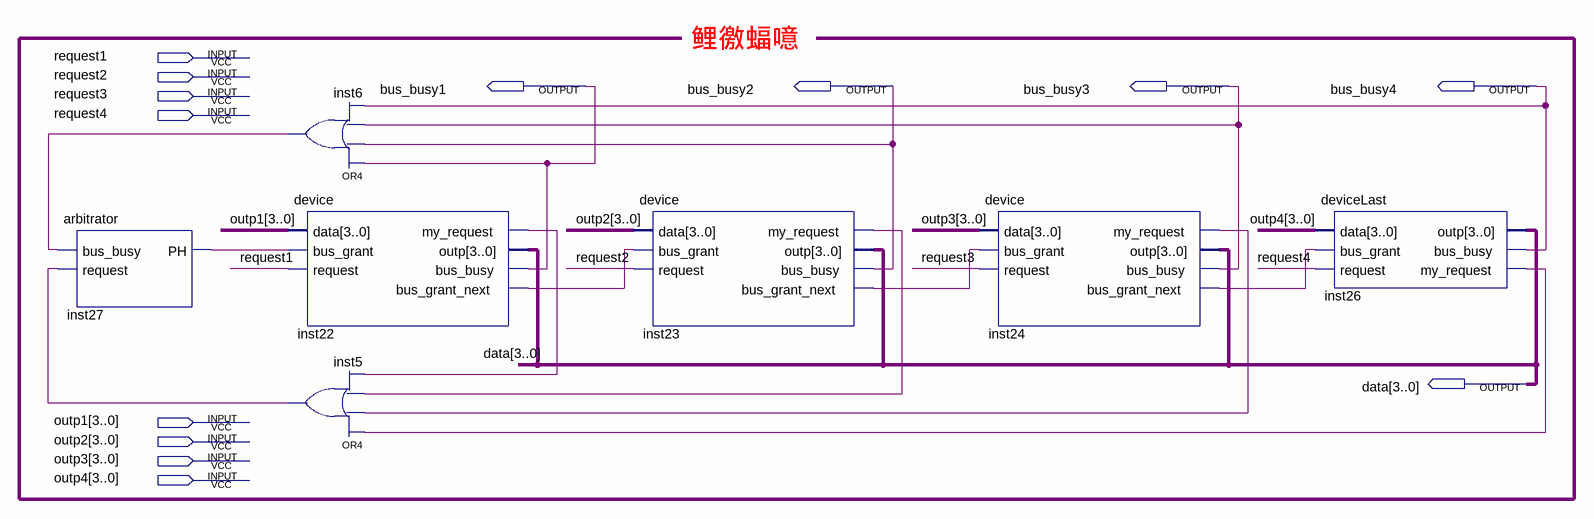
[diagram p0: schematic sheet]
// Quartus schematic Main.bdf as structural Verilog: 7 symbols, 13 pins
module Main (
  input  request1,
  input  request2,
  input  request3,
  input  request4,
  input  [3:0] outp1,
  input  [3:0] outp2,
  input  [3:0] outp3,
  input  [3:0] outp4,
  output bus_busy1,
  output bus_busy2,
  output bus_busy3,
  output bus_busy4,
  output [3:0] data
);

  wire inst5_out, inst6_out, inst22_bus_grant_next, inst22_my_request, inst23_bus_grant_next,
       inst23_my_request, inst24_bus_grant_next, inst24_my_request, inst26_my_request, inst27_ph;

  arbitrator inst27 (.bus_busy(inst6_out), .request(inst5_out), .PH(inst27_ph));
  or inst6 (inst6_out, bus_busy1, bus_busy2, bus_busy3, bus_busy4);
  device inst22 (
    .data(outp1), .bus_grant(inst27_ph), .request(request1), .my_request(inst22_my_request), .outp(data),
    .bus_busy(bus_busy1), .bus_grant_next(inst22_bus_grant_next));
  or inst5 (inst5_out, inst26_my_request, inst24_my_request, inst23_my_request, inst22_my_request);
  device inst23 (
    .data(outp2), .bus_grant(inst22_bus_grant_next), .request(request2), .my_request(inst23_my_request),
    .outp(data), .bus_busy(bus_busy2), .bus_grant_next(inst23_bus_grant_next));
  device inst24 (
    .data(outp3), .bus_grant(inst23_bus_grant_next), .request(request3), .my_request(inst24_my_request),
    .outp(data), .bus_busy(bus_busy3), .bus_grant_next(inst24_bus_grant_next));
  deviceLast inst26 (
    .data(outp4), .bus_grant(inst24_bus_grant_next), .request(request4), .outp(data), .bus_busy(bus_busy4),
    .my_request(inst26_my_request));

  // Notes on the sheet:
  //   鲤徼蝠噫
endmodule
